# Altium schematic sheet cover.SchDoc: Cover
size A4; Organization: GPA Robotics; DocumentNumber: 1; SheetNumber: 1; SheetTotal: 2
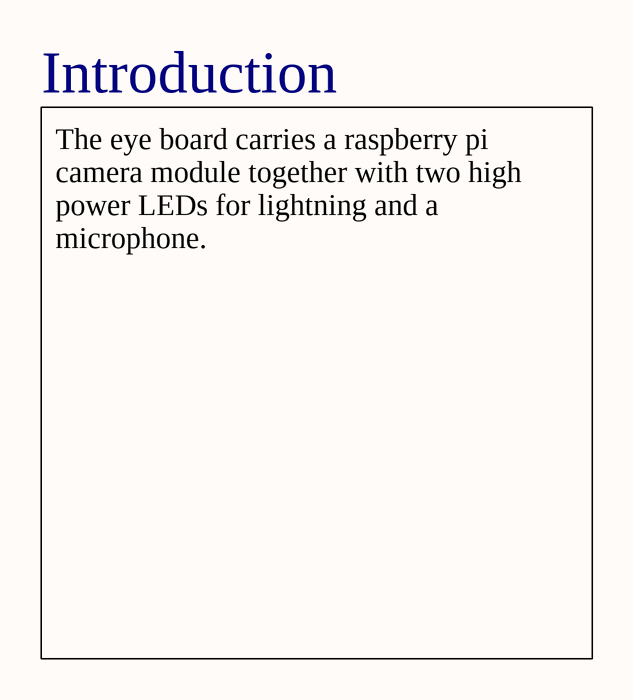
[diagram p0: cover.SchDoc]

## Notes on the sheet
- Introduction
- The eye board carries a raspberry pi camera module together with two high power LEDs for lightning and a microphone.
- Variant:
- Title
- Size:
- Date:
- A4
- Number:
- Time:
- Revision:
- Sheet
- of
- Repo: